# EAGLE design LSM6DSM_breakout (EAGLE 8.2.2)
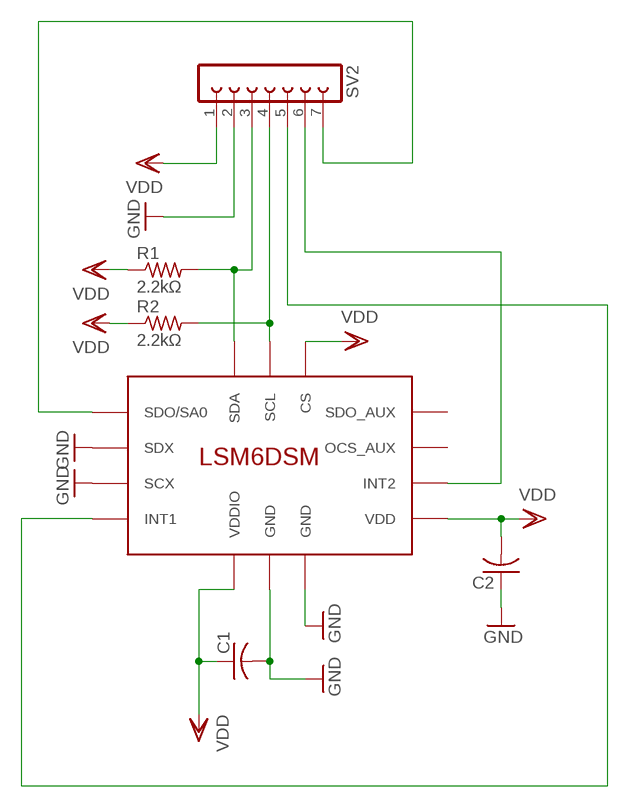
[diagram p0: schematic, sheet 1]

## Parts
C1  C-USC0805  [C0805]
C2  C-USC0805  [C0805]
R1  2.2kΩ  R-US_M0805  [M0805]
R2  2.2kΩ  R-US_M0805  [M0805]
SV2  FE07-1  [FE07]
U$1  LSM6DSM  [LSM6DSM]

## Nets
GND: C1.2 C2.1 SV2.2 U$1.GND@1(GND) U$1.GND@2(GND) U$1.SCX U$1.SDX
N$1: SV2.5 U$1.INT1
N$2: R1.2 SV2.3 U$1.SDA
N$3: R2.2 SV2.4 U$1.SCL
N$4: SV2.6 U$1.INT2
N$5: SV2.7 U$1.SDO/SA0
VDD: C1.1 C2.2 R1.1 R2.1 SV2.1 U$1.CS U$1.VDD U$1.VDDIO
Unconnected: U$1.OCS_AUX U$1.SDO_AUX

## Library data of the parts
C1 C2 = rcl:C-US: CAPACITOR, American symbol
R1 R2 = rcl:R-US_: RESISTOR, American symbol
SV2 = con-lsta:FE07-1: FEMALE HEADER; OC_FARNELL: unknown; OC_NEWARK: unknown
U$1 = LSM6DSM:LSM6DSM

## Board
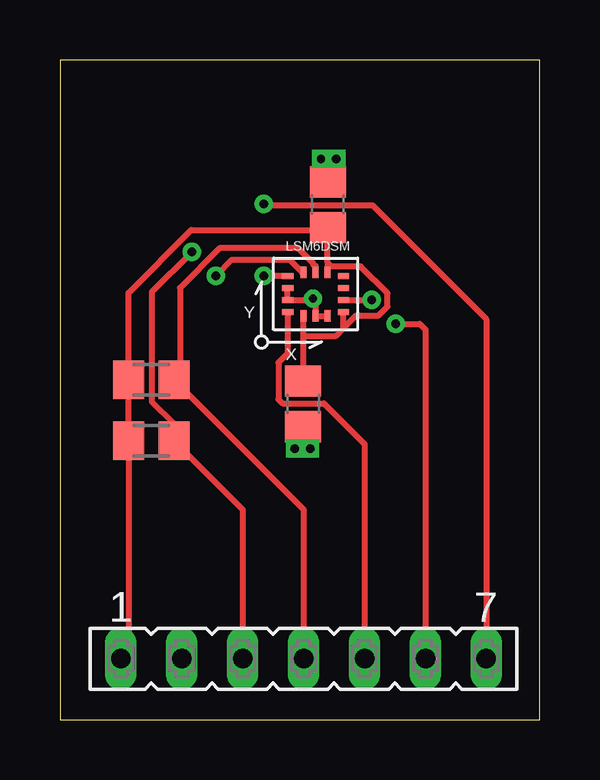
[diagram p1: board, top side]
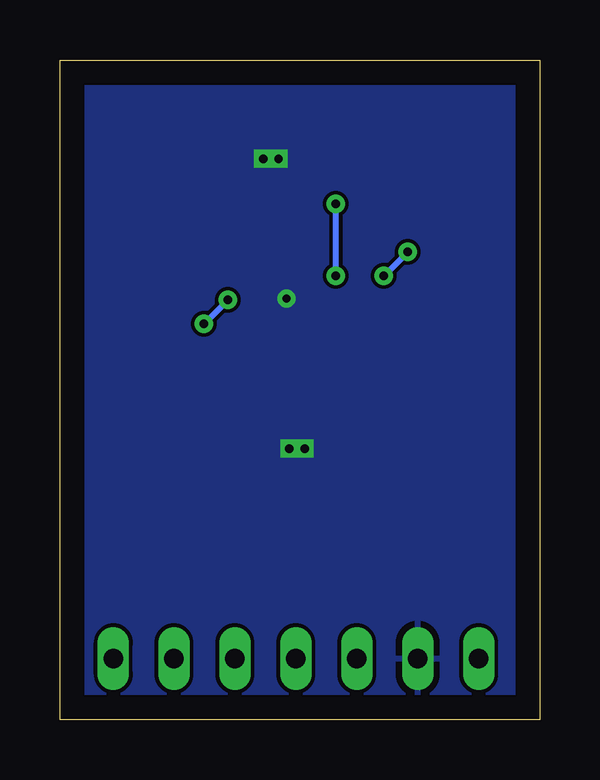
[diagram p2: board, bottom side, seen from below]

Size 20 x 27.5 mm. Coordinates in mm from the lower left corner, seen from the top.
Outline: 0,0 20,0 20,27.5 0,27.5 0,0
Copper layers (1*16): Top 0.035mm / dielectric 1.5mm / Bottom 0.035mm
Design rules "default": minimum track width 6mil, minimum drill 0.35mm, track to track 6mil, track to pad 6mil, pad to pad 6mil, via to via 6mil, smd to smd 6mil, copper to edge 40mil, drill to drill 6mil, minimum pad ring 10mil, minimum via ring 8mil, stop-mask expansion 4mil, vias tented up to drill 0mil, thermal gap 10mil

### Footprints (pad centres in the part's own frame; a part is rotated, then mirrored left to right if it is on the bottom)
C0805 = smd 1.3 x 1.5: 1 -0.95,0; 2 0.95,0
M0805 = smd 1.3 x 1.6: 1 -0.95,0; 2 0.95,0
FE07 = drill 0.813 long: 1 -7.62,0; 2 -5.08,0; 3 -2.54,0; 4 0,0; 5 2.54,0; 6 5.08,0; 7 7.62,0
LSM6DSM = smd 0.25 x 0.475: CS 0.5,0.912; GND@1 0,-0.912; GND@2 0.5,-0.912; SCL 0,0.912; SDA -0.5,0.912; VDDIO -0.5,-0.912 | smd 0.475 x 0.25: INT1 -1.163,-0.75; INT2 1.163,-0.25; OCS_AUX 1.163,0.25; SCX -1.163,-0.25; SDO/SA0 -1.163,0.75; SDO_AUX 1.163,0.75; SDX -1.163,0.25; VDD 1.163,-0.75

### Placement (x,y rotation side)
C1  11.17,21.47 90 top
C2  10.14,13.16 90 top
R1  3.81,11.62 0 top
R2  3.81,14.16 0 top
SV2  10.16,2.54 0 top
U$1  10.66,17.74 0 top

### Tracks (layer width: path | path; a pad name or v marks a point on that pad's centre or on a via)
GND  (via drill 0.35)
  Top 0.254: U$1.SDX U$1.SCX 10.5,17.5 | 10.5,17.5 10.66,17.34 U$1.GND@1 U$1.GND@2 | 10.5,17.5 v10.55,17.55 | v10.89,23.38 10.89,22.7 C1.2 11.52,22.76 v11.52,23.38 | v10.43,11.3 10.43,11.92 10.24,12.11 | 10.24,12.11 C2.1 | v9.8,11.3 9.8,11.67 10.24,12.11
  Bottom 0.254: v10.55,17.55 10.5,17.5
  pour Bottom: 0,0 0,27.71 20.09,27.71 20.09,0
N$1
  Top 0.254: U$1.INT1 9.5,15.26 9.11,14.88 9.11,13.34 9.27,13.18 11.01,13.18 12.7,11.49 SV2.5
N$2  (via drill 0.35)
  Top 0.254: SV2.3 7.62,8.76 R1.2 4.76,12.32 3.83,13.24 3.83,17.83 v5.5,19.5 | U$1.SDA 10.09,18.65 9.59,19.16 7.16,19.16 v6.5,18.5
  Bottom 0.254: v6.5,18.5 v5.5,19.5
N$3
  Top 0.254: 4.89,14.03 R2.2 | 4.89,14.03 10.16,8.76 SV2.4 | U$1.SCL 10.66,18.91 10.56,18.96 10.56,19.01 9.92,19.65 6.65,19.65 5,18 5,14.13 4.89,14.03
N$4  (via drill 0.35)
  Top 0.254: U$1.INT2 11.83,17.5 v13,17.5 | SV2.6 15.24,16.26 15,16.5 v14,16.5
  Bottom 0.254: v13,17.5 v14,16.5
N$5  (via drill 0.35)
  Top 0.254: U$1.SDO/SA0 9.49,18.5 v8.5,18.5 | v8.5,21.5 8.55,21.45 13.04,21.45 17.78,16.7 SV2.7
  Bottom 0.254: v8.5,18.5 v8.5,21.5
VDD
  Top 0.254: C2.2 10.16,14.13 10.16,16 | 10.16,16 U$1.VDDIO | 10.16,16 11.5,16 11.82,16.32 | 11.82,16.32 U$1.VDD | 11.16,19.06 U$1.CS | 11.16,19.06 11.16,20.5 C1.1 11.06,20.41 5.48,20.41 2.86,17.79 R2.1 R1.1 2.86,2.54 SV2.1 | 11.82,16.32 12.34,16.84 13.27,16.84 13.66,17.23 13.66,17.77 12.54,18.89 11.33,18.89 11.16,19.06

### Text on the board
tDocu: LSM6DSM | VDD | GND | SDA | SCL | INT1 | INT2 | SDO/SA0